# EAGLE schematic hc-vitaminder (EAGLE 9.5.1)
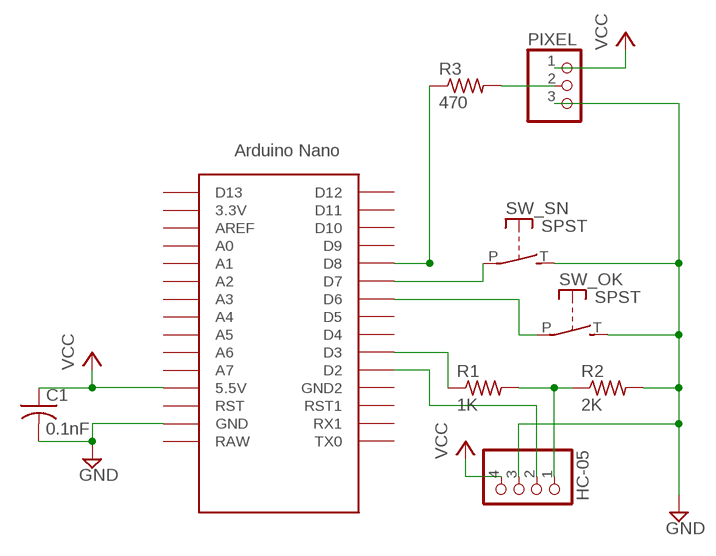
[diagram p0: schematic, sheet 1]

## Parts
C1  0.1nF  C-US025-024X044  [C025-024X044]
HC-05  PINHD-1X4  [1X04]
PIXEL  PINHD-1X3  [1X03]
R1  1K  R-US_0309/12  [0309/12]
R2  2K  R-US_0309/12  [0309/12]
R3  470  R-US_0309/12  [0309/12]
SW_OK  SPST  [JUDCOSPST]
SW_SN  SPST  [JUDCOSPST]
U$1  NANO  [NANO]

## Nets
GND: C1.2 HC-05.3 PIXEL.3 R2.2 SW_OK.T(S) SW_SN.T(S) U$1.GND
N$1: HC-05.1 R1.2 R2.1
N$2: R1.1 U$1.D3
N$3: R3.1 U$1.D8
N$4: HC-05.2 U$1.D2
N$5: PIXEL.2 R3.2
N$10: SW_SN.P U$1.D7
N$11: SW_OK.P U$1.D6
VCC: C1.1 HC-05.4 PIXEL.1 U$1.5V(5.5V)
Unconnected: U$1.3.3V U$1.A0 U$1.A1 U$1.A2 U$1.A3 U$1.A4 U$1.A5 U$1.A6 U$1.A7 U$1.AREF U$1.D4 U$1.D5 U$1.D9 U$1.D10 U$1.D11 U$1.D12 U$1.D13 U$1.GND1(GND2) U$1.ICSP1 U$1.ICSP2 U$1.ICSP3 U$1.ICSP4 U$1.ICSP5 U$1.ICSP6 U$1.RAW U$1.RST U$1.RST1 U$1.RX1 U$1.TX0

## Library data of the parts
C1 = akstudios-adafruit:C-US: CAPACITOR, American symbol
HC-05 = pinhead:PINHD-1X4: PIN HEADER
PIXEL = pinhead:PINHD-1X3: PIN HEADER
R1-R3 = akstudios-adafruit:R-US_: RESISTOR, American symbol
SW_OK SW_SN = akstudios-adafruit:SPST: Judco 50-0015-00
U$1 = hedgecourt:NANO: Arduino Nano